# Altium schematic sheet MCU.SchDoc
size A4
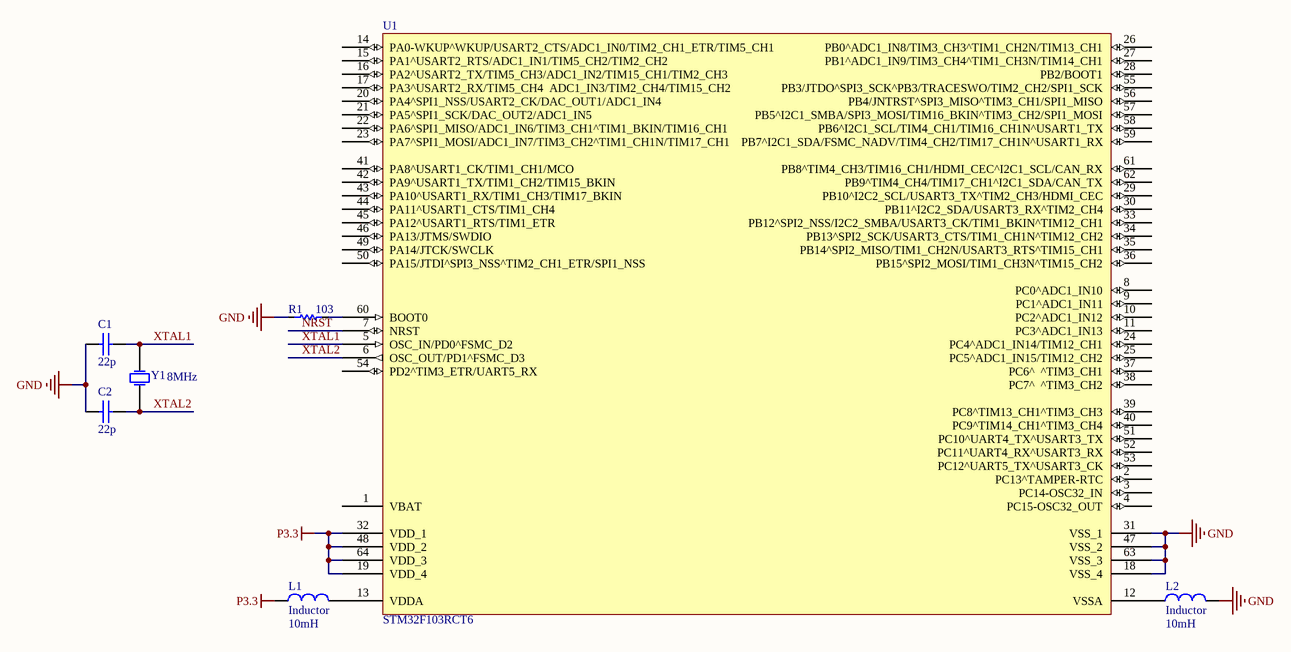
[diagram p0: MCU.SchDoc]

## Parts
C1  value 22p  [CAP_SMD_0805]  (hidden comment: Cap Non-pol)
C2  value 22p  [CAP_SMD_0805]  (hidden comment: Cap Non-pol)
L1  Inductor  value 10mH  [L-0805]
L2  Inductor  value 10mH  [L-0805]
R1  value 103  [RES_SMD_0805]  (hidden comment: RESISTOR)
U1  STM32F103RCT6  [TQFP64L]
Y1  8MHz  [XTAL]

## Nets
GND: C1.1 C2.1 L2.2 R1.1 U1.18(VSS_4) U1.31(VSS_1) U1.47(VSS_2) U1.63(VSS_3)
P3.3: L1.1 U1.19(VDD_4) U1.32(VDD_1) U1.48(VDD_2) U1.64(VDD_3)
NRST: U1.7(NRST)
XTAL1: C1.2 U1.5(OSC_IN/PD0^FSMC_D2) Y1.2(OSC2)
XTAL2: C2.2 U1.6(OSC_OUT/PD1^FSMC_D3) Y1.1(OSC1)
NetL1_2: L1.2 U1.13(VDDA)
NetL2_1: L2.1 U1.12(VSSA)
NetR1_2: R1.2 U1.60(BOOT0)

Not connected (* = marked no-connect by the designer): U1 1(VBAT) 2(PC13^TAMPER-RTC) 3(PC14-OSC32_IN) 4(PC15-OSC32_OUT) 8(PC0^ADC1_IN10) 9(PC1^ADC1_IN11) 10(PC2^ADC1_IN12) 11(PC3^ADC1_IN13) 14(PA0-WKUP^WKUP/USART2_CTS/ADC1_IN0/TIM2_CH1_ETR/TIM5_CH1) 15(PA1^USART2_RTS/ADC1_IN1/TIM5_CH2/TIM2_CH2) 16(PA2^USART2_TX/TIM5_CH3/ADC1_IN2/TIM15_CH1/TIM2_CH3) 17(PA3^USART2_RX/TIM5_CH4__ADC1_IN3/TIM2_CH4/TIM15_CH2) 20(PA4^SPI1_NSS/USART2_CK/DAC_OUT1/ADC1_IN4) 21(PA5^SPI1_SCK/DAC_OUT2/ADC1_IN5) 22(PA6^SPI1_MISO/ADC1_IN6/TIM3_CH1^TIM1_BKIN/TIM16_CH1) 23(PA7^SPI1_MOSI/ADC1_IN7/TIM3_CH2^TIM1_CH1N/TIM17_CH1) 24(PC4^ADC1_IN14/TIM12_CH1) 25(PC5^ADC1_IN15/TIM12_CH2) 26(PB0^ADC1_IN8/TIM3_CH3^TIM1_CH2N/TIM13_CH1) 27(PB1^ADC1_IN9/TIM3_CH4^TIM1_CH3N/TIM14_CH1) 28(PB2/BOOT1) 29(PB10^I2C2_SCL/USART3_TX^TIM2_CH3/HDMI_CEC) 30(PB11^I2C2_SDA/USART3_RX^TIM2_CH4) 33(PB12^SPI2_NSS/I2C2_SMBA/USART3_CK/TIM1_BKIN^TIM12_CH1) 34(PB13^SPI2_SCK/USART3_CTS/TIM1_CH1N^TIM12_CH2) 35(PB14^SPI2_MISO/TIM1_CH2N/USART3_RTS^TIM15_CH1) 36(PB15^SPI2_MOSI/TIM1_CH3N^TIM15_CH2) 37(PC6^__^TIM3_CH1) 38(PC7^__^TIM3_CH2) 39(PC8^TIM13_CH1^TIM3_CH3) 40(PC9^TIM14_CH1^TIM3_CH4) 41(PA8^USART1_CK/TIM1_CH1/MCO) 42(PA9^USART1_TX/TIM1_CH2/TIM15_BKIN) 43(PA10^USART1_RX/TIM1_CH3/TIM17_BKIN) 44(PA11^USART1_CTS/TIM1_CH4) 45(PA12^USART1_RTS/TIM1_ETR) 46(PA13/JTMS/SWDIO) 49(PA14/JTCK/SWCLK) 50(PA15/JTDI^SPI3_NSS^TIM2_CH1_ETR/SPI1_NSS) 51(PC10^UART4_TX^USART3_TX) 52(PC11^UART4_RX^USART3_RX) 53(PC12^UART5_TX^USART3_CK) 54(PD2^TIM3_ETR/UART5_RX) 55(PB3/JTDO^SPI3_SCK^PB3/TRACESWO/TIM2_CH2/SPI1_SCK) 56(PB4/JNTRST^SPI3_MISO^TIM3_CH1/SPI1_MISO) 57(PB5^I2C1_SMBA/SPI3_MOSI/TIM16_BKIN^TIM3_CH2/SPI1_MOSI) 58(PB6^I2C1_SCL/TIM4_CH1/TIM16_CH1N^USART1_TX) 59(PB7^I2C1_SDA/FSMC_NADV/TIM4_CH2/TIM17_CH1N^USART1_RX) 61(PB8^TIM4_CH3/TIM16_CH1/HDMI_CEC^I2C1_SCL/CAN_RX) 62(PB9^TIM4_CH4/TIM17_CH1^I2C1_SDA/CAN_TX)

## Library data of the parts
C1 C2 = Cap Non-pol: Non-polarized Capacitor; LatestRevisionNote: Re-released for DXP Platform.; PackageReference: RAD-0.3; Publisher: Altium Limited
L1 L2 = Inductor: Code_IEC: 1005; Published: 8-Jun-2000; LatestRevisionDate: 17-Jul-2002; LatestRevisionNote: Re-released for DXP Platform.; PackageReference: 0402-A; Publisher: Altium Limited; Code_JEITA: 0402
U1 = STM32F103RCT6: MCU 32-bit STM32F1 ARM Cortex M3 RISC 64KB Flash 2.5V/3.3V 64-Pin LQFP Tray
Y1 = XTAL: Crystal Oscillator; Published: 8-Jun-2000; LatestRevisionDate: 17-Jul-2002; LatestRevisionNote: Re-released for DXP Platform.; PackageReference: R38; Publisher: Altium Limited
R1 = RESISTOR: Published: 8-Jun-2000; LatestRevisionDate: 17-Jul-2002; LatestRevisionNote: Re-released for DXP Platform.; PackageReference: AXIAL-0.3; Publisher: Altium Limited